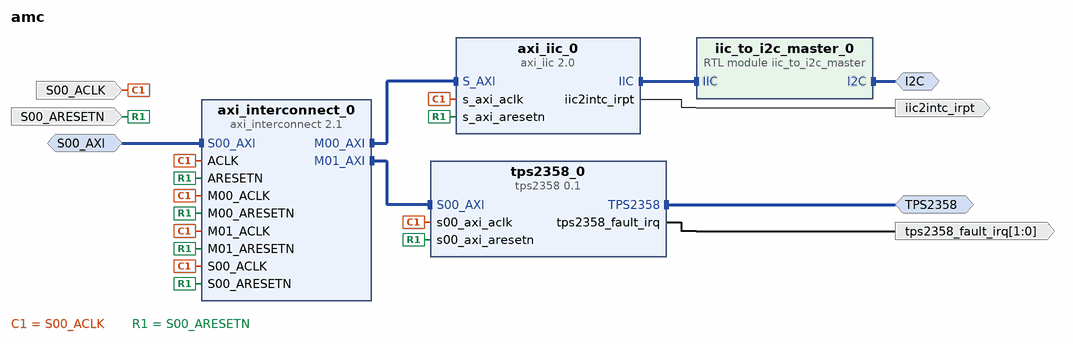
[diagram p0: block diagram of the top level]
# Vivado block design amc, xc7z020clg400-1, Vivado 2016.4
create_bd_design amc

create_bd_intf_port -mode Master -vlnv uw:uw:i2c_rtl:1.0 I2C
create_bd_intf_port -mode Master -vlnv uw:uw:tps2358_rtl:1.0 TPS2358
create_bd_intf_port -mode Slave -vlnv xilinx.com:interface:aximm_rtl:1.0 S00_AXI
set_property -dict [list \
  CONFIG.DATA_WIDTH 32 \
  CONFIG.PROTOCOL AXI4 \
  CONFIG.ID_WIDTH 0 \
  CONFIG.ADDR_WIDTH 32 \
  CONFIG.AWUSER_WIDTH 0 \
  CONFIG.ARUSER_WIDTH 0 \
  CONFIG.WUSER_WIDTH 0 \
  CONFIG.RUSER_WIDTH 0 \
  CONFIG.BUSER_WIDTH 0 \
  CONFIG.READ_WRITE_MODE READ_WRITE \
  CONFIG.HAS_BURST 1 \
  CONFIG.HAS_LOCK 1 \
  CONFIG.HAS_PROT 1 \
  CONFIG.HAS_CACHE 1 \
  CONFIG.HAS_QOS 1 \
  CONFIG.HAS_REGION 0 \
  CONFIG.HAS_WSTRB 1 \
  CONFIG.HAS_BRESP 1 \
  CONFIG.HAS_RRESP 1 \
  CONFIG.SUPPORTS_NARROW_BURST 1 \
  CONFIG.NUM_READ_OUTSTANDING 2 \
  CONFIG.NUM_WRITE_OUTSTANDING 2 \
  CONFIG.MAX_BURST_LENGTH 256 \
  CONFIG.NUM_READ_THREADS 1 \
  CONFIG.NUM_WRITE_THREADS 1 \
  CONFIG.RUSER_BITS_PER_BYTE 0 \
  CONFIG.WUSER_BITS_PER_BYTE 0 \
] [get_bd_intf_ports S00_AXI]
create_bd_port -dir I -type clk S00_ACLK
create_bd_port -dir I -type rst S00_ARESETN
create_bd_port -dir O -type intr iic2intc_irpt
create_bd_port -dir O -from 1 -to 0 -type intr tps2358_fault_irq

create_bd_cell -type ip -vlnv xilinx.com:ip:axi_iic:2.0 axi_iic_0
create_bd_cell -type module -reference iic_to_i2c_master iic_to_i2c_master_0
create_bd_cell -type ip -vlnv user.org:user:tps2358:0.1 tps2358_0
create_bd_cell -type ip -vlnv xilinx.com:ip:axi_interconnect:2.1 axi_interconnect_0

# ---- connections ----

connect_bd_intf_net [get_bd_intf_pins axi_iic_0/IIC] [get_bd_intf_pins iic_to_i2c_master_0/IIC]
connect_bd_intf_net [get_bd_intf_pins axi_interconnect_0/M00_AXI] [get_bd_intf_pins axi_iic_0/S_AXI]
connect_bd_intf_net [get_bd_intf_pins axi_interconnect_0/M01_AXI] [get_bd_intf_pins tps2358_0/S00_AXI]
connect_bd_intf_net [get_bd_intf_ports I2C] [get_bd_intf_pins iic_to_i2c_master_0/I2C]
connect_bd_intf_net [get_bd_intf_ports TPS2358] [get_bd_intf_pins tps2358_0/TPS2358]
connect_bd_intf_net [get_bd_intf_ports S00_AXI] [get_bd_intf_pins axi_interconnect_0/S00_AXI]
connect_bd_net [get_bd_ports S00_ACLK] \
  [get_bd_pins axi_iic_0/s_axi_aclk] [get_bd_pins tps2358_0/s00_axi_aclk] [get_bd_pins axi_interconnect_0/ACLK] \
  [get_bd_pins axi_interconnect_0/S00_ACLK] [get_bd_pins axi_interconnect_0/M00_ACLK] \
  [get_bd_pins axi_interconnect_0/M01_ACLK]
connect_bd_net [get_bd_ports S00_ARESETN] \
  [get_bd_pins axi_iic_0/s_axi_aresetn] [get_bd_pins tps2358_0/s00_axi_aresetn] [get_bd_pins axi_interconnect_0/M01_ARESETN] \
  [get_bd_pins axi_interconnect_0/M00_ARESETN] [get_bd_pins axi_interconnect_0/S00_ARESETN] \
  [get_bd_pins axi_interconnect_0/ARESETN]
connect_bd_net [get_bd_pins axi_iic_0/iic2intc_irpt] [get_bd_ports iic2intc_irpt]
connect_bd_net [get_bd_pins tps2358_0/tps2358_fault_irq] [get_bd_ports tps2358_fault_irq]

# ---- address map ----
assign_bd_address -offset 0x40800000 -range 64K -target_address_space [get_bd_addr_spaces S00_AXI] [get_bd_addr_segs axi_iic_0/S_AXI/Reg]
assign_bd_address -offset 0x44A00000 -range 64K -target_address_space [get_bd_addr_spaces S00_AXI] [get_bd_addr_segs tps2358_0/S00_AXI/S00_AXI_reg]

validate_bd_design
save_bd_design
